# Altium schematic sheet Urukul_FPGA_LVDS.SchDoc: Fastino
size 420 x 297 mm; EDA_Number: ARTIQ; Projet: Fastino; Author: G.Kasprowicz; CompanyName: WUT ISE; DrawnBy: G.Kasprowicz; Organization: WUT ISE; Address1: PW ISE; Address2: Nowowiejska 15/19 00-665 Warsaw; Address3: gkasprow@gmail.com; DocumentNumber: 4; Revision: 2; SheetNumber: 5; SheetTotal: 11; ModifiedBy: -; CheckedDate: -; Title2: FPGA EEM connections; DivGrp: WUT ISE; Designer: G.Kasprowicz; SPICEModelCacheRFUWQEQD: <root> / <DocumentId>RFUWQEQD</DocumentId> / <CacheFrame Number="0"> / <Model Name="pk14" Kind="CKT"> / <Text>*.INC dhvqfn.s / .SUBCKT pk14 / +    1   2   3   4   5   6   7   8   9  10 / +   11  12  13  14 / +   15  16  17  18  19  20  21  22  23  24 / +   25  26  27  28 / * Pin Resistance / r1 1 1001 9.078E-02 / r2 2 1002 8.829E-02 / r3 3 1003 8.731E-02 / r4 4 1004 8.710E-02 / r5 5 1005 8.731E-02 / r6 6 1006 8.829E-02 / r7 7 1007 9.075E-02 / r8 8 1008 9.072E-02 / r9 9 1009 8.809E-02 / r10 10 1010 8.716E-02 / r11 11 1011 8.706E-02 / r12 12 1012 8.720E-02 / r13 13 1013 8.816E-02 / r14 14 1014 9.068E-02 / * Pin Inductance / l1 1001 15 2.981E-09 / l2 1002 16 2.447E-09 / l3 1003 17 2.304E-09 / l4 1004 18 2.291E-09 / l5 1005 19 2.307E-09 / l6 1006 20 2.449E-09 / l7 1007 21 2.971E-09 / l8 1008 22 2.972E-09 / l9 1009 23 2.425E-09 / l10 1010 24 2.286E-09 / l11 1011 25 2.280E-09 / l12 1012 26 2.286E-09 / l13 1013 27 2.425E-09 / l14 1014 28 2.975E-09 / .ENDS pk14</Text> / </Model> / </CacheFrame> / </root>; ModifiedDate: -; ProjectName: Sensor Box
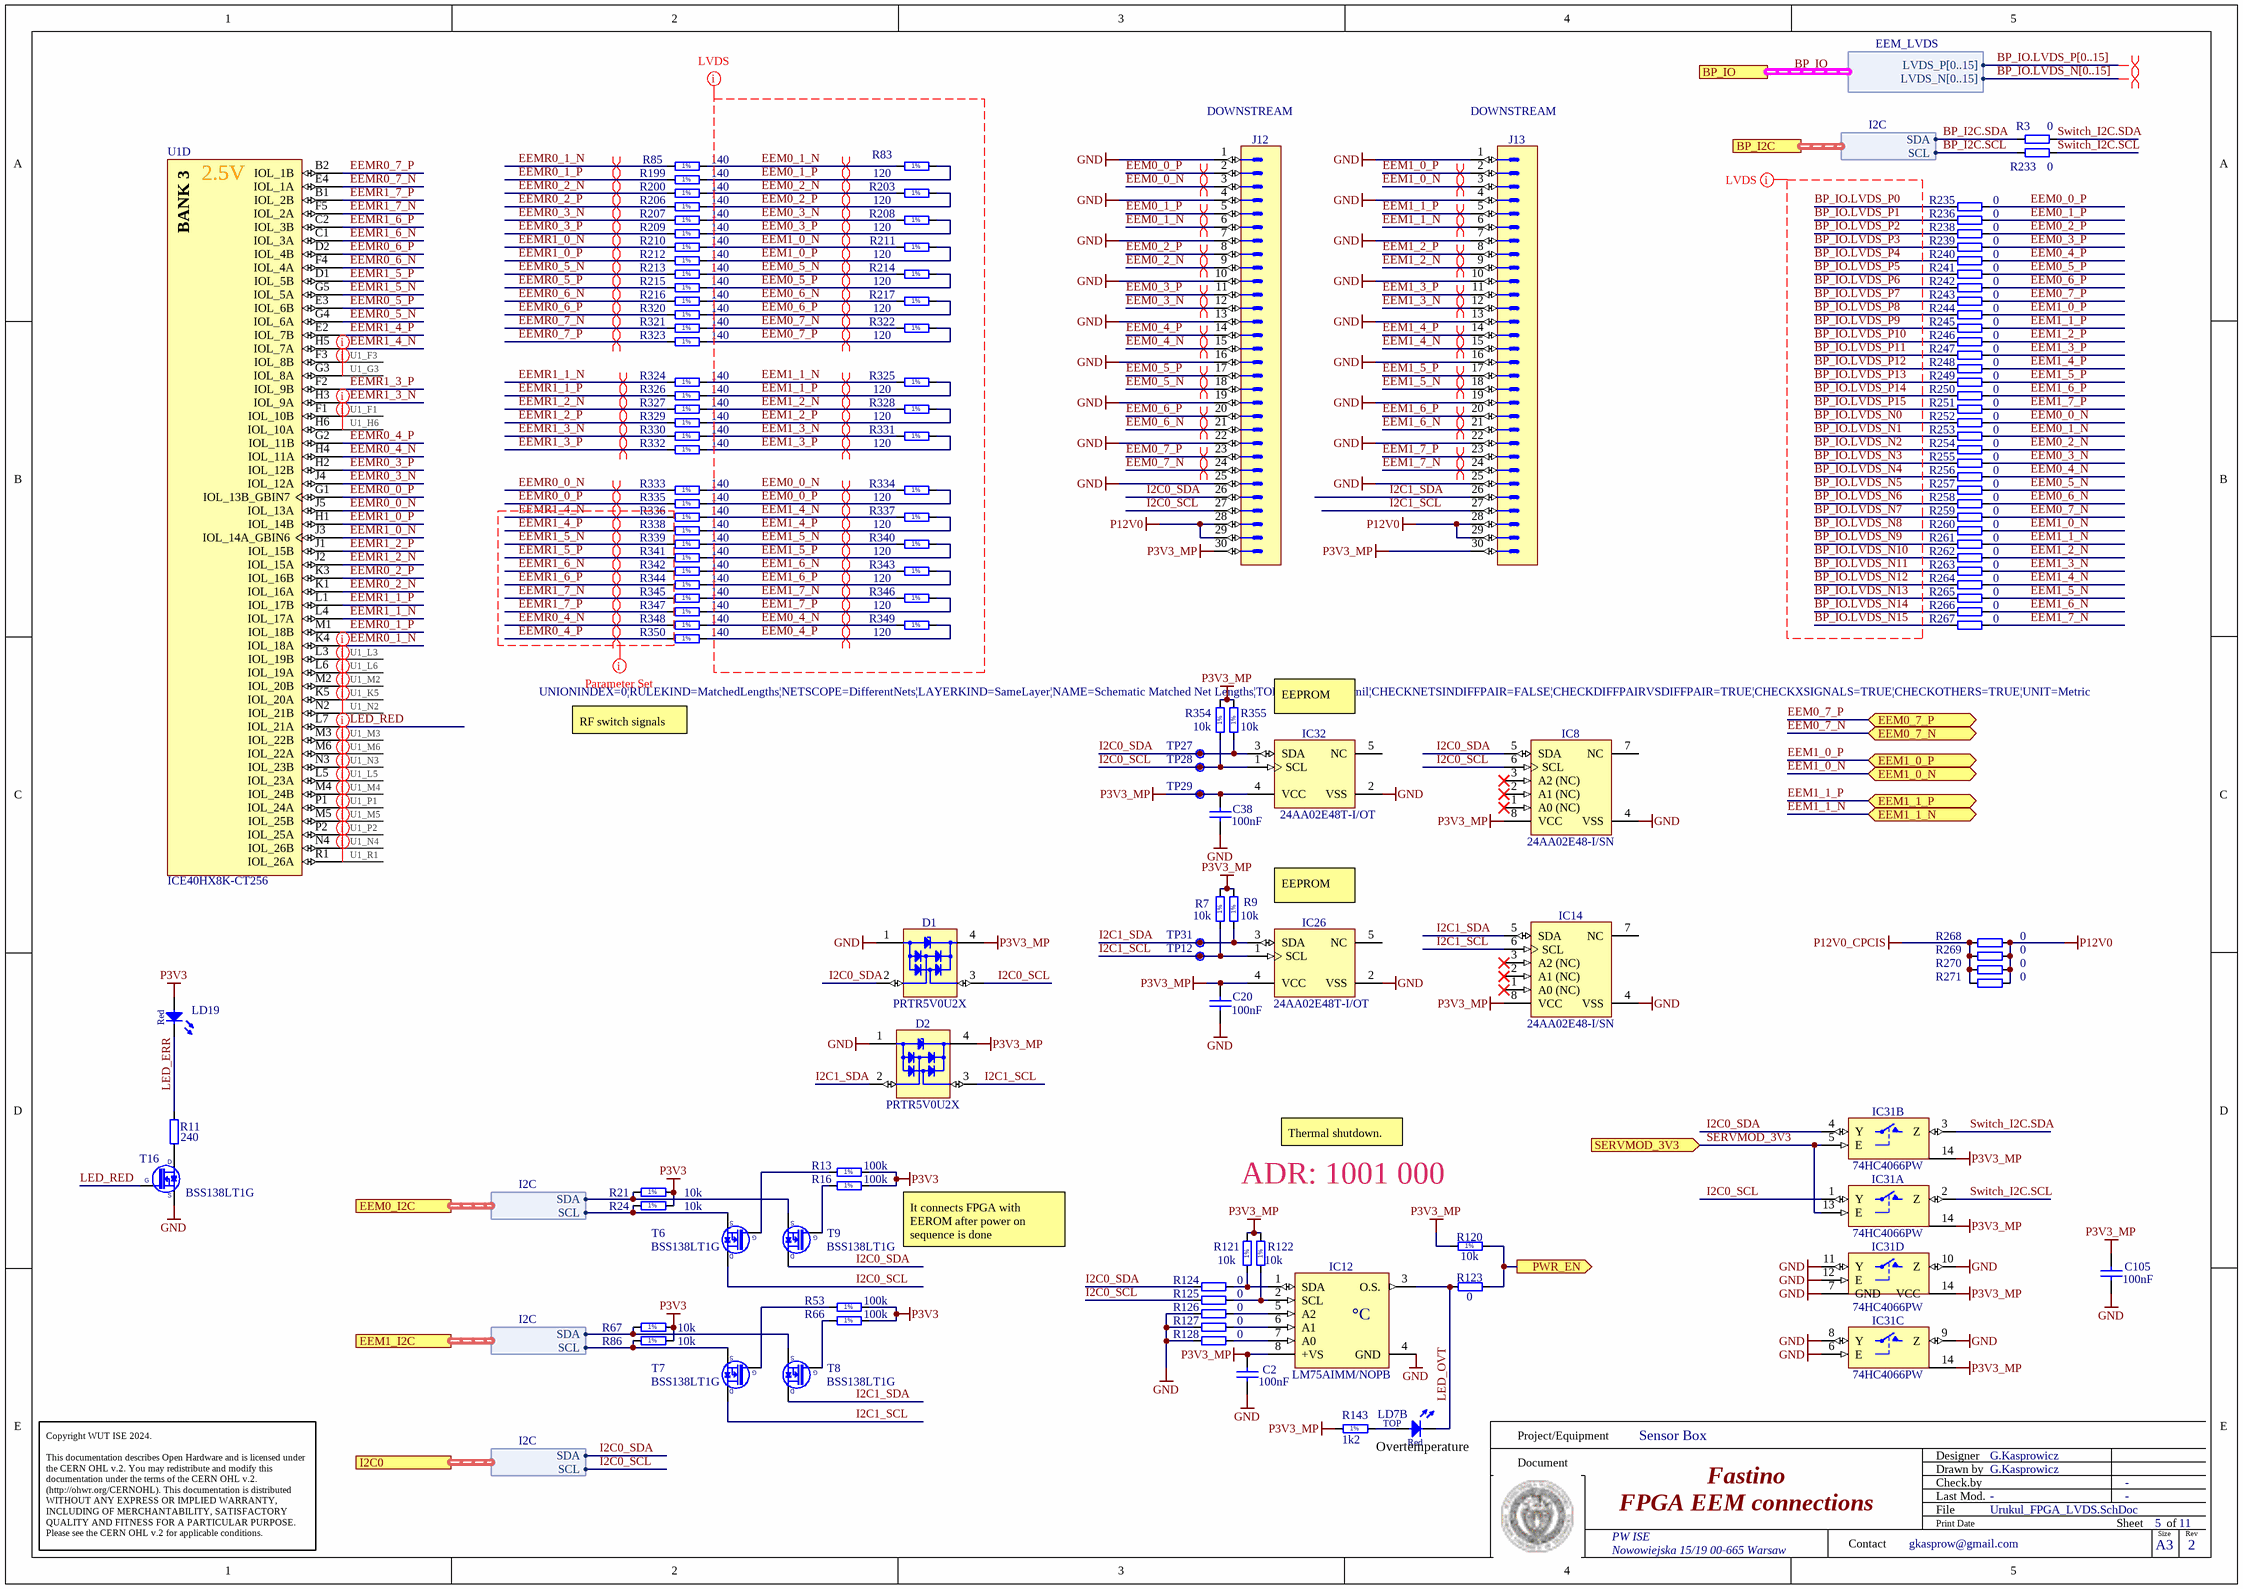
[diagram p0: Urukul_FPGA_LVDS.SchDoc]

## Parts
C2  100nF  [CAPC1005X55N]
C20  100nF  [CAPC1005X55N]
C38  100nF  [CAPC1005X55N]
C105  100nF  [CAPC1005X55N]
D1  PRTR5V0U2X  [SOT190P230X110-4N]
D2  PRTR5V0U2X  [SOT190P230X110-4N]
IC8  24AA02E48-I/SN  [SOIC127P600X175-8N]
IC12  LM75AIMM/NOPB  [SOP65P490X109-8N]
IC14  24AA02E48-I/SN  [SOIC127P600X175-8N]
IC26  24AA02E48T-I/OT  [SOT95P280X145-5N]
IC31  74HC4066PW  [SOP65P640X110-14N]  (parts A,B,C,D of 4)
IC32  24AA02E48T-I/OT  [SOT95P280X145-5N]
J12  (no value)  [3M_N2530-6002RB]
J13  (no value)  [3M_N2530-6002RB]
LD7  Red/Green  [LED_DIALIGHT_571-0112F]  (value not drawn)  (part B of 2)
LD19  Red  [LED_AVAGO_HSMC-C120]
R3  0  [RESC1005X40N]
R7  10k  [RESC1005X40N]
R9  10k  [RESC1005X40N]
R11  240  [RESC1005X40N]
R13  100k  [RESC1005X40N]
R16  100k  [RESC1005X40N]
R21  10k  [RESC1005X40N]
R24  10k  [RESC1005X40N]
R53  100k  [RESC1005X40N]
R66  100k  [RESC1005X40N]
R67  10k  [RESC1005X40N]
R83  120  [RESC1005X40N]
R85  140  [RESC0603X28N]
R86  10k  [RESC1005X40N]
R120  10k  [RESC1005X40N]
R121  10k  [RESC1005X40N]
R122  10k  [RESC1005X40N]
R123  0  [RESC1005X40N]
R124  0  [RESC1005X40N]
R125  0  [RESC1005X40N]
R126  0  [RESC1005X40N]
R127  0  [RESC1005X40N]
R128  0  [RESC1005X40N]
R143  1k2  [RESC1608X55N]
R199  140  [RESC0603X28N]
R200  140  [RESC0603X28N]
R203  120  [RESC1005X40N]
R206  140  [RESC0603X28N]
R207  140  [RESC0603X28N]
R208  120  [RESC1005X40N]
R209  140  [RESC0603X28N]
R210  140  [RESC0603X28N]
R211  120  [RESC1005X40N]
R212  140  [RESC0603X28N]
R213  140  [RESC0603X28N]
R214  120  [RESC1005X40N]
R215  140  [RESC0603X28N]
R216  140  [RESC0603X28N]
R217  120  [RESC1005X40N]
R233  0  [RESC1005X40N]
R235  0  [RESC1005X40N]
R236  0  [RESC1005X40N]
R238  0  [RESC1005X40N]
R239  0  [RESC1005X40N]
R240  0  [RESC1005X40N]
R241  0  [RESC1005X40N]
R242  0  [RESC1005X40N]
R243  0  [RESC1005X40N]
R244  0  [RESC1005X40N]
R245  0  [RESC1005X40N]
R246  0  [RESC1005X40N]
R247  0  [RESC1005X40N]
R248  0  [RESC1005X40N]
R249  0  [RESC1005X40N]
R250  0  [RESC1005X40N]
R251  0  [RESC1005X40N]
R252  0  [RESC1005X40N]
R253  0  [RESC1005X40N]
R254  0  [RESC1005X40N]
R255  0  [RESC1005X40N]
R256  0  [RESC1005X40N]
R257  0  [RESC1005X40N]
R258  0  [RESC1005X40N]
R259  0  [RESC1005X40N]
R260  0  [RESC1005X40N]
R261  0  [RESC1005X40N]
R262  0  [RESC1005X40N]
R263  0  [RESC1005X40N]
R264  0  [RESC1005X40N]
R265  0  [RESC1005X40N]
R266  0  [RESC1005X40N]
R267  0  [RESC1005X40N]
R268  0  [RESC1005X40N]
R269  0  [RESC1005X40N]
R270  0  [RESC1005X40N]
R271  0  [RESC1005X40N]
R320  140  [RESC0603X28N]
R321  140  [RESC0603X28N]
R322  120  [RESC1005X40N]
R323  140  [RESC0603X28N]
R324  140  [RESC0603X28N]
R325  120  [RESC1005X40N]
R326  140  [RESC0603X28N]
R327  140  [RESC0603X28N]
R328  120  [RESC1005X40N]
R329  140  [RESC0603X28N]
R330  140  [RESC0603X28N]
R331  120  [RESC1005X40N]
R332  140  [RESC0603X28N]
R333  140  [RESC0603X28N]
R334  120  [RESC1005X40N]
R335  140  [RESC0603X28N]
R336  140  [RESC0603X28N]
R337  120  [RESC1005X40N]
R338  140  [RESC0603X28N]
R339  140  [RESC0603X28N]
R340  120  [RESC1005X40N]
R341  140  [RESC0603X28N]
R342  140  [RESC0603X28N]
R343  120  [RESC1005X40N]
R344  140  [RESC0603X28N]
R345  140  [RESC0603X28N]
R346  120  [RESC1005X40N]
R347  140  [RESC0603X28N]
R348  140  [RESC0603X28N]
R349  120  [RESC1005X40N]
R350  140  [RESC0603X28N]
R354  10k  [RESC1005X40N]
R355  10k  [RESC1005X40N]
T6  BSS138LT1G  [SOT95P240X110-3N]
T7  BSS138LT1G  [SOT95P240X110-3N]
T8  BSS138LT1G  [SOT95P240X110-3N]
T9  BSS138LT1G  [SOT95P240X110-3N]
T16  BSS138LT1G  [SOT95P240X110-3N]
TP12  Test Point  [TPS127]  (value not drawn)  (no BOM)
TP27  Test Point  [TPS127]  (value not drawn)  (no BOM)
TP28  Test Point  [TPS127]  (value not drawn)  (no BOM)
TP29  Test Point  [TPS127]  (value not drawn)  (no BOM)
TP31  Test Point  [TPS127]  (value not drawn)  (no BOM)
U1  ICE40HX8K-CT256  [LATC-caBGA-256]  (part D of 5)

## Ports
BP_I2C (harness I2C), BP_IO (harness EEM_LVDS), EEM0_7_N (bidir), EEM0_7_P (bidir), EEM0_I2C (harness I2C), EEM1_0_N (bidir), EEM1_0_P (bidir), EEM1_1_N (bidir), EEM1_1_P (bidir), EEM1_I2C (harness I2C), I2C0 (harness I2C), PWR_EN (out), SERVMOD_3V3 (in)

## Harnesses
I2C: SDA, SCL
EEM_LVDS: LVDS_P[0..15], LVDS_N[0..15]

## Nets
GND: C2.1 C20.1 C38.1 C105.1 D1.1(GND) D2.1(GND) IC8.4(VSS) IC12.4(GND) IC14.4(VSS) IC26.2(VSS) IC31.6(E) IC31.7(GND) IC31.8(Y) IC31.9(Z) IC31.10(Z) IC31.11(Y) IC31.12(E) IC32.2(VSS) J12.1 J12.4 J12.7 J12.10 J12.13 J12.16 J12.19 J12.22 J12.25 J13.1 J13.4 J13.7 J13.10 J13.13 J13.16 J13.19 J13.22 J13.25 R126.1 R127.1 R128.1 T16.2(S)
P3V3: LD19.2(A) R13.2 R16.2 R21.2 R24.2 R53.2 R66.2 R67.2 R86.2
P3V3_MP: C2.2 C20.2 C38.2 C105.2 D1.4(VCC) D2.4(VCC) IC8.8(VCC) IC12.8(+VS) IC14.8(VCC) IC26.4(VCC) IC31.14(VCC) IC32.4(VCC) J12.30 J13.30 R7.2 R9.2 R120.1 R121.2 R122.2 R143.1 R354.2 R355.2 TP29.1
P12V0: J12.28 J12.29 J13.28 J13.29 R268.2 R269.2 R270.2 R271.2
P12V0_CPCIS: R268.1 R269.1 R270.1 R271.1
BP_I2C.SCL: R233.1 ; port BP_I2C.SCL
BP_I2C.SDA: R3.1 ; port BP_I2C.SDA
BP_IO.LVDS_N0: R252.1
BP_IO.LVDS_N1: R253.1
BP_IO.LVDS_N2: R254.1
BP_IO.LVDS_N3: R255.1
BP_IO.LVDS_N4: R256.1
BP_IO.LVDS_N5: R257.1
BP_IO.LVDS_N6: R258.1
BP_IO.LVDS_N7: R259.1
BP_IO.LVDS_N8: R260.1
BP_IO.LVDS_N9: R261.1
BP_IO.LVDS_N10: R262.1
BP_IO.LVDS_N11: R263.1
BP_IO.LVDS_N12: R264.1
BP_IO.LVDS_N13: R265.1
BP_IO.LVDS_N14: R266.1
BP_IO.LVDS_N15: R267.1
BP_IO.LVDS_P0: R235.1
BP_IO.LVDS_P1: R236.1
BP_IO.LVDS_P2: R238.1
BP_IO.LVDS_P3: R239.1
BP_IO.LVDS_P4: R240.1
BP_IO.LVDS_P5: R241.1
BP_IO.LVDS_P6: R242.1
BP_IO.LVDS_P7: R243.1
BP_IO.LVDS_P8: R244.1
BP_IO.LVDS_P9: R245.1
BP_IO.LVDS_P10: R246.1
BP_IO.LVDS_P11: R247.1
BP_IO.LVDS_P12: R248.1
BP_IO.LVDS_P13: R249.1
BP_IO.LVDS_P14: R250.1
BP_IO.LVDS_P15: R251.1
EEM0_0_N: J12.3 R252.2 R333.2 R334.1
EEM0_0_P: J12.2 R235.2 R334.2 R335.2
EEM0_1_N: J12.6 R83.1 R85.2 R253.2
EEM0_1_P: J12.5 R83.2 R199.2 R236.2
EEM0_2_N: J12.9 R200.2 R203.1 R254.2
EEM0_2_P: J12.8 R203.2 R206.2 R238.2
EEM0_3_N: J12.12 R207.2 R208.1 R255.2
EEM0_3_P: J12.11 R208.2 R209.2 R239.2
EEM0_4_N: J12.15 R256.2 R348.2 R349.1
EEM0_4_P: J12.14 R240.2 R349.2 R350.2
EEM0_5_N: J12.18 R213.2 R214.1 R257.2
EEM0_5_P: J12.17 R214.2 R215.2 R241.2
EEM0_6_N: J12.21 R216.2 R217.1 R258.2
EEM0_6_P: J12.20 R217.2 R242.2 R320.2
EEM0_7_N: J12.24 R259.2 R321.2 R322.1 ; port EEM0_7_N
EEM0_7_P: J12.23 R243.2 R322.2 R323.2 ; port EEM0_7_P
EEM1_0_N: J13.3 R210.2 R211.1 R260.2 ; port EEM1_0_N
EEM1_0_P: J13.2 R211.2 R212.2 R244.2 ; port EEM1_0_P
EEM1_1_N: J13.6 R261.2 R324.2 R325.1 ; port EEM1_1_N
EEM1_1_P: J13.5 R245.2 R325.2 R326.2 ; port EEM1_1_P
EEM1_2_N: J13.9 R262.2 R327.2 R328.1
EEM1_2_P: J13.8 R246.2 R328.2 R329.2
EEM1_3_N: J13.12 R263.2 R330.2 R331.1
EEM1_3_P: J13.11 R247.2 R331.2 R332.2
EEM1_4_N: J13.15 R264.2 R336.2 R337.1
EEM1_4_P: J13.14 R248.2 R337.2 R338.2
EEM1_5_N: J13.18 R265.2 R339.2 R340.1
EEM1_5_P: J13.17 R249.2 R340.2 R341.2
EEM1_6_N: J13.21 R266.2 R342.2 R343.1
EEM1_6_P: J13.20 R250.2 R343.2 R344.2
EEM1_7_N: J13.24 R267.2 R345.2 R346.1
EEM1_7_P: J13.23 R251.2 R346.2 R347.2
EEMR0_0_N: R333.1 U1.J5(IOL_13A)
EEMR0_0_P: R335.1 U1.G1(IOL_13B_GBIN7)
EEMR0_1_N: R85.1 U1.K4(IOL_18A)
EEMR0_1_P: R199.1 U1.M1(IOL_18B)
EEMR0_2_N: R200.1 U1.K1(IOL_16A)
EEMR0_2_P: R206.1 U1.K3(IOL_16B)
EEMR0_3_N: R207.1 U1.J4(IOL_12A)
EEMR0_3_P: R209.1 U1.H2(IOL_12B)
EEMR0_4_N: R348.1 U1.H4(IOL_11A)
EEMR0_4_P: R350.1 U1.G2(IOL_11B)
EEMR0_5_N: R213.1 U1.G4(IOL_6A)
EEMR0_5_P: R215.1 U1.E3(IOL_6B)
EEMR0_6_N: R216.1 U1.F4(IOL_4A)
EEMR0_6_P: R320.1 U1.D2(IOL_4B)
EEMR0_7_N: R321.1 U1.E4(IOL_1A)
EEMR0_7_P: R323.1 U1.B2(IOL_1B)
EEMR1_0_N: R210.1 U1.J3(IOL_14A_GBIN6)
EEMR1_0_P: R212.1 U1.H1(IOL_14B)
EEMR1_1_N: R324.1 U1.L4(IOL_17A)
EEMR1_1_P: R326.1 U1.L1(IOL_17B)
EEMR1_2_N: R327.1 U1.J2(IOL_15A)
EEMR1_2_P: R329.1 U1.J1(IOL_15B)
EEMR1_3_N: R330.1 U1.H3(IOL_9A)
EEMR1_3_P: R332.1 U1.F2(IOL_9B)
EEMR1_4_N: R336.1 U1.H5(IOL_7A)
EEMR1_4_P: R338.1 U1.E2(IOL_7B)
EEMR1_5_N: R339.1 U1.G5(IOL_5A)
EEMR1_5_P: R341.1 U1.D1(IOL_5B)
EEMR1_6_N: R342.1 U1.C1(IOL_3A)
EEMR1_6_P: R344.1 U1.C2(IOL_3B)
EEMR1_7_N: R345.1 U1.F5(IOL_2A)
EEMR1_7_P: R347.1 U1.B1(IOL_2B)
I2C0_SCL: D1.3(I/O2) IC8.6(SCL) IC31.1(Y) IC32.1(SCL) J12.27 R125.1 R354.1 T6.3(D) TP28.1 ; port I2C0.SCL
I2C0_SDA: D1.2(I/O1) IC8.5(SDA) IC31.4(Y) IC32.3(SDA) J12.26 R124.1 R355.1 T9.3(D) TP27.1 ; port I2C0.SDA
I2C1_SCL: D2.3(I/O2) IC14.6(SCL) IC26.1(SCL) J13.27 R7.1 T7.3(D) TP12.1
I2C1_SDA: D2.2(I/O1) IC14.5(SDA) IC26.3(SDA) J13.26 R9.1 T8.3(D) TP31.1
LED_ERR: LD19.1(C) R11.1
LED_OVT: IC12.3(O.S.) LD7.3(C) R123.1
LED_RED: T16.1(G) U1.L7(IOL_21A)
PWR_EN: R120.2 R123.2 ; port PWR_EN
SERVMOD_3V3: IC31.5(E) IC31.13(E) ; port SERVMOD_3V3
Switch_I2C.SCL: IC31.2(Z) R233.2
Switch_I2C.SDA: IC31.3(Z) R3.2
U1_F1: U1.F1(IOL_10B)
U1_F3: U1.F3(IOL_8B)
U1_G3: U1.G3(IOL_8A)
U1_H6: U1.H6(IOL_10A)
U1_K5: U1.K5(IOL_20A)
U1_L3: U1.L3(IOL_19B)
U1_L5: U1.L5(IOL_23A)
U1_L6: U1.L6(IOL_19A)
U1_M2: U1.M2(IOL_20B)
U1_M3: U1.M3(IOL_22B)
U1_M4: U1.M4(IOL_24B)
U1_M5: U1.M5(IOL_25B)
U1_M6: U1.M6(IOL_22A)
U1_N2: U1.N2(IOL_21B)
U1_N3: U1.N3(IOL_23B)
U1_N4: U1.N4(IOL_26B)
U1_P1: U1.P1(IOL_24A)
U1_P2: U1.P2(IOL_25A)
U1_R1: U1.R1(IOL_26A)
NetIC12_1: IC12.1(SDA) R121.1 R124.2
NetIC12_2: IC12.2(SCL) R122.1 R125.2
NetIC12_5: IC12.5(A2) R126.2
NetIC12_6: IC12.6(A1) R127.2
NetIC12_7: IC12.7(A0) R128.2
NetLD7_4: LD7.4(A) R143.2
NetR11_2: R11.2 T16.3(D)
NetR13_1: R13.1 T6.1(G)
NetR16_1: R16.1 T9.1(G)
NetR21_1: R21.1 T9.2(S) ; port EEM0_I2C.SDA
NetR24_1: R24.1 T6.2(S) ; port EEM0_I2C.SCL
NetR53_1: R53.1 T7.1(G)
NetR66_1: R66.1 T8.1(G)
NetR67_1: R67.1 T8.2(S) ; port EEM1_I2C.SDA
NetR86_1: R86.1 T7.2(S) ; port EEM1_I2C.SCL

Not connected (* = marked no-connect by the designer): IC8 1(A0_(NC))* 2(A1_(NC))* 3(A2_(NC))* 7(NC); IC14 1(A0_(NC))* 2(A1_(NC))* 3(A2_(NC))* 7(NC); IC26 5(NC); IC32 5(NC)

## Buses and harness runs
bus BP_IO.LVDS_N[0..15]
bus BP_IO.LVDS_P[0..15]
harness BP_IO = port BP_IO

## Layout directives
differential pair: EEM0_0_N, EEM0_0_P, EEM0_1_N, EEM0_1_P, EEM0_2_N, EEM0_2_P, EEM0_3_N, EEM0_3_P, EEM0_4_N, EEM0_4_P, EEM0_5_N, EEM0_5_P, EEM0_6_N, EEM0_6_P, EEM0_7_N, EEM0_7_P, EEM1_0_N, EEM1_0_P, EEM1_1_N, EEM1_1_P, EEM1_2_N, EEM1_2_P, EEM1_3_N, EEM1_3_P, EEM1_4_N, EEM1_4_P, EEM1_5_N, EEM1_5_P, EEM1_6_N, EEM1_6_P, EEM1_7_N, EEM1_7_P, EEMR0_0_N, EEMR0_0_P, EEMR0_1_N, EEMR0_1_P, EEMR0_2_N, EEMR0_2_P, EEMR0_3_N, EEMR0_3_P, EEMR0_4_N, EEMR0_4_P, EEMR0_5_N, EEMR0_5_P, EEMR0_6_N, EEMR0_6_P, EEMR0_7_N, EEMR0_7_P, EEMR1_0_N, EEMR1_0_P, EEMR1_1_N, EEMR1_1_P, EEMR1_2_N, EEMR1_2_P, EEMR1_3_N, EEMR1_3_P, EEMR1_4_N, EEMR1_4_P, EEMR1_5_N, EEMR1_5_P, EEMR1_6_N, EEMR1_6_P, EEMR1_7_N, EEMR1_7_P
net class LVDS: BP_IO.LVDS_N0, BP_IO.LVDS_N1, BP_IO.LVDS_N2, BP_IO.LVDS_N3, BP_IO.LVDS_N4, BP_IO.LVDS_N5, BP_IO.LVDS_N6, BP_IO.LVDS_N7, BP_IO.LVDS_N8, BP_IO.LVDS_N9, BP_IO.LVDS_N10, BP_IO.LVDS_N11, BP_IO.LVDS_N12, BP_IO.LVDS_N13, BP_IO.LVDS_N14, BP_IO.LVDS_N15, BP_IO.LVDS_P0, BP_IO.LVDS_P1, BP_IO.LVDS_P2, BP_IO.LVDS_P3, BP_IO.LVDS_P4, BP_IO.LVDS_P5, BP_IO.LVDS_P6, BP_IO.LVDS_P7, BP_IO.LVDS_P8, BP_IO.LVDS_P9, BP_IO.LVDS_P10, BP_IO.LVDS_P11, BP_IO.LVDS_P12, BP_IO.LVDS_P13, BP_IO.LVDS_P14, BP_IO.LVDS_P15, EEM0_0_N, EEM0_0_P, EEM0_1_N, EEM0_1_P, EEM0_2_N, EEM0_2_P, EEM0_3_N, EEM0_3_P, EEM0_4_N, EEM0_4_P, EEM0_5_N, EEM0_5_P, EEM0_6_N, EEM0_6_P, EEM0_7_N, EEM0_7_P, EEM1_0_N, EEM1_0_P, EEM1_1_N, EEM1_1_P, EEM1_2_N, EEM1_2_P, EEM1_3_N, EEM1_3_P, EEM1_4_N, EEM1_4_P, EEM1_5_N, EEM1_5_P, EEM1_6_N, EEM1_6_P, EEM1_7_N, EEM1_7_P
differential pair; differential pair class Diff_100Ohm: (no net found under the mark)
rule Matched Net Lengths [Tolerance = 2.54mm]; net class RFSW_CPLD: EEMR0_4_N, EEMR0_4_P, EEMR1_4_N, EEMR1_4_P, EEMR1_5_N, EEMR1_5_P, EEMR1_6_N, EEMR1_6_P, EEMR1_7_N, EEMR1_7_P
net class Unused: U1_F1, U1_F3, U1_G3, U1_H6, U1_K5, U1_L3, U1_L5, U1_L6, U1_M2, U1_M3, U1_M4, U1_M5, U1_M6, U1_N2, U1_N3, U1_N4, U1_P1, U1_P2, U1_R1

## Notes on the sheet
- (near J12) DOWNSTREAM
- (near J13) DOWNSTREAM
- 2.5V
- RF switch signals
- EEPROM
- ADR: 1001 000
- Thermal shutdown.
- It connects FPGA with EEROM after power on sequence is done
- Overtemperature
- Project/Equipment
- Document
- Designer
- Drawn by
- Check.by
- Copyright WUT ISE 2024.
  This documentation describes Open Hardware and is licensed under the CERN OHL v.2. You may redistribute and modify this documentation under the terms of the CERN OHL v.2. (http://ohwr.org/CERNOHL). This documentation is distributed WITHOUT ANY EXPRESS OR IMPLIED WARRANTY, INCLUDING OF MERCHANTABILITY, SATISFACTORY QUALITY AND FITNESS FOR A PARTICULAR PURPOSE. Please see the CERN OHL v.2 for applicable conditions.
- Contact
- File
- Last Mod.
- Print Date
- Sheet
- Size
- A3
- of
- Rev
- (in symbol CMP-0962-00001-1, part D) BANK 3
- (in symbol LED_DIALIGHT_571-0112F, part B) TOP; Red
- (in symbol LM75AIMM/NOPB) °C
- (in symbol R0201_140R_1%_0.05W_200PPM) 1%
- (in symbol R0402_10k_1%_0.0625W_100PPM) 1%
- (in symbol R0402_10K_1%_0.0625W_100PPM) 1%
- (in symbol R0402_100K_1%_0.0625W_100PPM) 1%
- (in symbol R0402_120R_1%_0.0625W_100PPM) 1%
- (in symbol R0603_1K2_1%_0.1W_100PPM) 1%

## Library data of the parts
C2 C20 C38 C105 = CC0402_100NF_16V_10%_X5R: Non-polarised capacitor; Part Description: SMD Multilayer Chip Ceramic Capacitor; Manufacturer: GENERIC; Manufacturer1 Part Number: GRM155R61C104KA88D; Voltage: 16V; TC: X5R; Tolerance: ±10%; Part Number: CC0402_100NF_16V_10%_X5R; Component Kind: Standard; Component Type: Standard; Pin Count: 2; Value: 100nF; Status: None; Manufacturer Part Number: CC0402_100NF_16V_10%_X5R; Case: 0402; Mounted: Yes; Socket: No; SMD: Yes; Sense: No; Manufacturer1 Example: MURATA; Manufacturer1 ComponentHeight: 0.55mm; HelpURL: \\cern.ch\dfs\Applications\Altium\Datasheets\CC0402_X5R_MURATA_GRM.pdf; Author: CERN DEM JLC; CreateDate: 10.12.2013; LatestRevisionDate: 10.12.2013
D1 D2 = PRTR5V0U2X: Ultra Low Capacitance Double Rail-to-Rail ESD Protection Diode; Part Description: Ultra Low Capacitance (1pF) Double Rail-to-Rail ESD Protection Diode (8kV); Manufacturer: NXP SEMICONDUCTORS; Voltage: 5.5V; PressFit: No; Bonding: No; Part Number: PRTR5V0U2X; Component Kind: Standard; Component Type: Standard; Device: PRTR5V0U2X; PackageDescription: SOT143B, SOT, 1.90mm Pitch; 4 Pin, 1.30mm W X 2.90mm L X 1.10mm H body, IPC Medium Density; Manufacturer Part Number: PRTR5V0U2X; Pin Count: 4; Case: SOT143B; Mounted: Yes; Socket: No; SMD: Yes; Sense: No; ComponentHeight: 1.1mm; HelpURL: \\cern.ch\dfs\Applications\Altium\Datasheets\PRTR5V0U2X.pdf; Author: CERN DEM JLC; CreateDate: 22.03.2011; LatestRevisionDate: 22.03.2011
IC8 IC14 = MEM_24AA02E48-I/SN: 1.7V-5.5V, 2K I2C™ Serial EEPROMs with EUI-48™ Node Identity; Manufacturer: MICROCHIP TECHNOLOGY; PressFit: No; Bonding: No; Part Number: 24AA02E48-I/SN; Component Kind: Standard; Component Type: Standard; Device: 24AA02E48-I/SN; PackageDescription: SOIC, 1.27mm Pitch; 8 Pin - Body 4x5mm, IPC Medium Density; Part Description: 1.7V-5.5V, 2K I2C™ Serial EEPROMs with EUI-48™ Node Identity; Manufacturer Part Number: 24AA02E48-I/SN; Pin Count: 8; Case: SOIC8; Mounted: Yes; Socket: No; SMD: Yes; Sense: No; ComponentHeight: 1.75mm; HelpURL: \\cern.ch\dfs\Applications\Altium\Datasheets\24AA025E48-I-SN.pdf; Author: CERN DEM MR; CreateDate: 19.07.2016; LatestRevisionDate: 19.07.2016
IC12 = LM75AIMM/NOPB: Digital Temperature Sensor and Thermal Watchdog with Two-Wire Interface; Part Description: -25° to +100°C ±2°C Digital Temperature Sensor and Thermal Watchdog with Two-Wire Interface; Manufacturer: TEXAS INSTRUMENTS; PressFit: No; Bonding: No; Part Number: LM75AIMM/NOPB; Component Kind: Standard; Component Type: Standard; Device: LM75AIMM/NOPB; PackageDescription: SOP, 0.65mm pitch; 8 pin,3.00mm W X 3.00mm L X 1.09mm H bodyI, PC Medium Density; Manufacturer Part Number: LM75AIMM/NOPB; Pin Count: 8; Case: SSOP8; Mounted: Yes; Socket: No; SMD: Yes; Sense: No; ComponentHeight: 1.09mm; HelpURL: \\cern.ch\dfs\Applications\Altium\Datasheets\LM75AIMM-NOPB.pdf; Author: CERN DEM JLC; CreateDate: 15.10.2012; LatestRevisionDate: 15.10.2012
IC26 IC32 = 24AA02E48T-I/OT: 1.7V-5.5V, 2K I2C Serial EEPROM With EUI-48 Node Identity; Manufacturer: MICROCHIP TECHNOLOGY; PressFit: No; Bonding: No; Part Number: 24AA02E48T-I/OT; Component Kind: Standard; Component Type: Standard; Device: 24AA02E48T-I/OT; PackageDescription: SOT, 0.95mm pitch; 5 pin, 1.60mm W X 2.90mm L X 1.45mm H body, IPC Medium Density; Part Description: 1.7V-5.5V, 2K I2C Serial EEPROM With EUI-48 Node Identity; Manufacturer Part Number: 24AA02E48T-I/OT; Pin Count: 5; Case: SOT23-5; Mounted: Yes; Socket: No; SMD: Yes; Sense: No; ComponentHeight: 1.45mm; HelpURL: \\cern.ch\dfs\Applications\Altium\Datasheets\24AA02E48T-I-OT.pdf; Author: CERN DEM MR; CreateDate: 31.03.2016; LatestRevisionDate: 31.03.2016
IC31 = 74HC4066PW: Part Description: Quad Single-Pole Single-Throw Analog Switch; Manufacturer: NXP SEMICONDUCTORS; PressFit: No; Bonding: No; Table: Standard Logic; Part Number: 74HC4066PW; Component Kind: Standard; Component Type: Standard; Device: 74HC4066PW; PackageDescription: SOP, 14-Leads, Body 4.4x5mm (max), Pitch 0.65mm, IPC Medium Density; Manufacturer Part Number: 74HC4066PW; Pin Count: 14; Case: TSSOP14; Mounted: Yes; Socket: No; SMD: Yes; ComponentHeight: 1.1mm; Author: CERN DEM JLC; HelpURL: \\cern.ch\dfs\Applications\Altium\Datasheets\74HC4066PW.pdf; CreateDate: 2014-11-19; LatestRevisionDate: 2014-11-19
J12 J13 = 3M_N2530-6002RB: Connector 30 Male; Part Description: 30 Contacts - Straight .100'' x .100'' Low Profile Four-Wall Header, 2500 Series; Manufacturer: 3M; PressFit: No; Part Number: 3M_N2530-6002RB; Component Kind: Standard; Component Type: Standard; Pin Count: 30; Family: Header 30; Mounted: Yes; Socket: No; SMD: No; Sense: No; Status: None; Manufacturer Part Number: N2530-6002RB; ComponentHeight: 10.03mm; HelpURL: \\cern.ch\dfs\Applications\Altium\Datasheets\3M_N2530-6002RB.pdf; Author: CERN DEM JLC; CreateDate: 11.02.2009; LatestRevisionDate: 11.08.2009
LD7 = LED_DIALIGHT_571-0112F: 2x LED  Botom Green, Top Red; Part Description: Dual 2mm  LEDs, Red Top,Green Bot, CBI® Circuit Board Indicator (Without positioning pins); PressFit: No; Bonding: No; Part Number: LED_DIALIGHT_571-0112F; Component Kind: Standard; Component Type: Standard; Color: Red/Green; PackageDescription: 2x 2mm LED (Top: Red, Bot: Green) PCB Edge Mounting (Without positioning pins) DIALIGHT 571 Serie; Manufacturer: DIALIGHT; Manufacturer Part Number: 571-0112F; Pin Count: 4; Mounted: Yes; Socket: No; SMD: No; Sense: No; ComponentHeight: 8.6mm; HelpURL: \\cern.ch\dfs\Applications\Altium\Datasheets\LED_DIALIGHT_571-0112F.pdf; Author: CERN DEM JLC; CreateDate: 09.11.2009; LatestRevisionDate: 17.03.2010
LD19 = LED_AVAGO_HSMC-C120: LED Red 1C 2A; Part Description: High Performance Right Angle Chip Red LED; Manufacturer: AVAGO TECHNOLOGIES; PressFit: No; Bonding: No; Part Number: LED_AVAGO_HSMC-C120; Component Kind: Standard; Component Type: Standard; Color: Red; PackageDescription: Red Chip LED, 2-Leads, Body 1.7x1.1mm, Side Emitting Package; Manufacturer Part Number: HSMC-C120; Pin Count: 2; Mounted: Yes; Socket: No; SMD: Yes; Sense: No; ComponentHeight: 0.7mm; HelpURL: \\cern.ch\dfs\Applications\Altium\Datasheets\LED_AVAGO_HSMC-C120.pdf; ComponentLink1URL: \\cern.ch\dfs\Applications\Altium\Datasheets\LED_AVAGO_HSMC-C120_DESIGN-GUIDE.pdf; ComponentLink1Description: Design Guide; Author: CERN DEM JMW; CreateDate: 22.07.2009; LatestRevisionDate: 20.06.2012
R3 R233 R235 R236 R238-R271 = R0402_0R_JUMPER: Resistor; Part Description: 1A (0.05R Max DC Resistance) Zero Ohm Jumper; Manufacturer: GENERIC; Manufacturer1 Part Number: 232270591001L; PressFit: No; Part Number: R0402_0R_JUMPER; Component Kind: Standard; Component Type: Standard; Pin Count: 2; Value: 0; Status: Not Recommended; Manufacturer Part Number: R0402_0R_JUMPER; Case: 0402; Mounted: Yes; Sense: No; Socket: No; SMD: Yes; Manufacturer1 Example: YAGEO PHYCOMP; Manufacturer1 ComponentHeight: 0.4mm; HelpURL: \\cern.ch\dfs\Applications\Altium\Datasheets\R0402_Phycomp_RC0402.pdf; Author: CERN DEM JLC; CreateDate: 03.12.2007; LatestRevisionDate: 17.10.2012
R7 R9 R120-R122 R354 R355 = R0402_10K_1%_0.0625W_100PPM: Resistor - 1%; Part Description: General Purpose Thick Film Chip Resistor; Manufacturer: GENERIC; Manufacturer1 Part Number: 232270671003L; TC: ±100ppm/°C; PressFit: No; Part Number: R0402_10K_1%_0.0625W_100PPM; Component Kind: Standard; Component Type: Standard; Pin Count: 2; Value: 10k; Status: Not Recommended; Power: 0.0625W; Tolerance: ±1%; Manufacturer Part Number: R0402_10K_1%_0.0625W_100PPM; Case: 0402; Mounted: Yes; Sense: No; Socket: No; SMD: Yes; Manufacturer1 Example: YAGEO PHYCOMP; Manufacturer1 ComponentHeight: 0.4mm; HelpURL: \\cern.ch\dfs\Applications\Altium\Datasheets\R0402_Phycomp_RC0402.pdf; Author: CERN DEM JLC; CreateDate: 03.12.2007; LatestRevisionDate: 17.10.2012
R11 = R0402_240R_1%_0.0625W_100PPM: Resistor - 1%; Part Description: General Purpose Thick Film Chip Resistor; Manufacturer: GENERIC; Manufacturer1 Part Number: 232270672401L; TC: ±100ppm/°C; PressFit: No; Part Number: R0402_240R_1%_0.0625W_100PPM; Component Kind: Standard; Component Type: Standard; Pin Count: 2; Value: 240; Status: Not Recommended; Power: 0.0625W; Tolerance: ±1%; Manufacturer Part Number: R0402_240R_1%_0.0625W_100PPM; Case: 0402; Mounted: Yes; Sense: No; Socket: No; SMD: Yes; Manufacturer1 Example: YAGEO PHYCOMP; Manufacturer1 ComponentHeight: 0.4mm; HelpURL: \\cern.ch\dfs\Applications\Altium\Datasheets\R0402_Phycomp_RC0402.pdf; Author: CERN DEM JLC; CreateDate: 03.12.2007; LatestRevisionDate: 17.10.2012
R13 R16 R53 R66 = R0402_100K_1%_0.0625W_100PPM: Resistor - 1%; Part Description: General Purpose Thick Film Chip Resistor; Manufacturer: GENERIC; Manufacturer1 Part Number: 232270671004L; TC: ±100ppm/°C; PressFit: No; Part Number: R0402_100K_1%_0.0625W_100PPM; Component Kind: Standard; Component Type: Standard; Pin Count: 2; Value: 100k; Status: Not Recommended; Power: 0.0625W; Tolerance: ±1%; Manufacturer Part Number: R0402_100K_1%_0.0625W_100PPM; Case: 0402; Mounted: Yes; Sense: No; Socket: No; SMD: Yes; Manufacturer1 Example: YAGEO PHYCOMP; Manufacturer1 ComponentHeight: 0.4mm; HelpURL: \\cern.ch\dfs\Applications\Altium\Datasheets\R0402_Phycomp_RC0402.pdf; Author: CERN DEM JLC; CreateDate: 03/12/2007; LatestRevisionDate: 17/10/2012
R21 R24 R67 R86 = R0402_10k_1%_0.0625W_100PPM: Resistor - 1%; Part Description: General Purpose Thick Film Chip Resistor; Manufacturer: GENERIC; Manufacturer1 Part Number: 232270671003L; TC: ±100ppm/°C; PressFit: No; Part Number: R0402_10K_1%_0.0625W_100PPM; Component Kind: Standard; Component Type: Standard; Pin Count: 2; Value: 10k; Status: Not Recommended; Power: 0.0625W; Tolerance: ±1%; Manufacturer Part Number: R0402_10K_1%_0.0625W_100PPM; Case: 0402; Mounted: Yes; Sense: No; Socket: No; SMD: Yes; Manufacturer1 Example: YAGEO PHYCOMP; Manufacturer1 ComponentHeight: 0.4mm; HelpURL: \\cern.ch\dfs\Applications\Altium\Datasheets\R0402_Phycomp_RC0402.pdf; Author: CERN DEM JLC; CreateDate: 03.12.2007; LatestRevisionDate: 17.10.2012
R83 R203 R208 R211 R214 R217 R322 R325 R328 R331 R334 R337 R340 R343 R346 R349 = R0402_120R_1%_0.0625W_100PPM: Resistor - 1%; Part Description: General Purpose Thick Film Chip Resistor; Manufacturer: GENERIC; Manufacturer1 Part Number: 232270671201L; TC: ±100ppm/°C; PressFit: No; Part Number: R0402_120R_1%_0.0625W_100PPM; Component Kind: Standard; Component Type: Standard; Pin Count: 2; Value: 120; Status: Not Recommended; Power: 0.0625W; Tolerance: ±1%; Manufacturer Part Number: R0402_120R_1%_0.0625W_100PPM; Case: 0402; Mounted: Yes; Sense: No; Socket: No; SMD: Yes; Manufacturer1 Example: YAGEO PHYCOMP; Manufacturer1 ComponentHeight: 0.4mm; HelpURL: \\cern.ch\dfs\Applications\Altium\Datasheets\R0402_Phycomp_RC0402.pdf; Author: CERN DEM JLC; CreateDate: 03.12.2007; LatestRevisionDate: 17.10.2012
R85 R199 R200 R206 R207 R209 R210 R212 R213 R215 R216 R320 R321 R323 R324 R326 R327 R329 R330 R332 R333 R335 R336 R338 R339 R341 R342 R344 R345 R347 R348 R350 = R0201_140R_1%_0.05W_200PPM: Resistor - 1%; Part Description: Thick Film Chip Resistor; Manufacturer: GENERIC; Manufacturer1 Part Number: CRCW0201140RFNED; Power: 0.05W; TC: ±200ppm/°C; PressFit: No; Part Number: R0201_140R_1%_0.05W_200PPM; Component Kind: Standard; Component Type: Standard; Pin Count: 2; Value: 140; Status: Not Recommended; Tolerance: ±1%; Manufacturer Part Number: R0201_140R_1%_0.05W_200PPM; Case: 0201; Mounted: Yes; Sense: No; Socket: No; SMD: Yes; Manufacturer1 Example: VISHAY; Manufacturer1 ComponentHeight: 0.27mm; HelpURL: \\cern.ch\dfs\Applications\Altium\Datasheets\R0201_VISHAY_CRCW e3.pdf; Author: CERN DEM MR; CreateDate: 26/01/2016; LatestRevisionDate: 26/01/2016
R123-R128 = R0402_0R_JUMPER: Resistor; Part Description: 1A (0.05R Max DC Resistance) Zero Ohm Jumper; Manufacturer: GENERIC; Manufacturer1 Part Number: 232270591001L; Part Number: R0402_0R_JUMPER; Component Kind: Standard; Component Type: Standard; Pin Count: 2; Value: 0; Status: Not recommended; Manufacturer Part Number: R0402_0R_JUMPER; Case: 0402; Mounted: Yes; Sense: No; Socket: No; SMD: Yes; Manufacturer1 Example: YAGEO PHYCOMP; Manufacturer1 ComponentHeight: 0.4mm; HelpURL: \\cern.ch\dfs\Applications\Altium\Datasheets\R0402_Phycomp_RC0402.pdf; Author: CERN DEM JLC; CreateDate: 03.12.2007; LatestRevisionDate: 17.10.2012
R143 = R0603_1K2_1%_0.1W_100PPM: Resistor - 1%; Part Description: General Purpose Thick Film Chip Resistor; Manufacturer: GENERIC; Manufacturer1 Part Number: NRC06F1201TRF; Power: 0.1W; TC: ±100ppm/°C; Part Number: R0603_1K2_1%_0.1W_100PPM; Component Kind: Standard; Component Type: Standard; Pin Count: 2; Value: 1k2; Status: Preferred; Tolerance: ±1%; Manufacturer Part Number: R0603_1K2_1%_0.1W_100PPM; Case: 0603; Mounted: Yes; Sense: No; Socket: No; SMD: Yes; Manufacturer1 Example: NIC COMPONENT; Manufacturer1 ComponentHeight: 0.55mm; HelpURL: \\cern.ch\dfs\Applications\Altium\Datasheets\R0603_NIC_NRC.pdf; Author: CERN DEM JLC; CreateDate: 03.12.2007; LatestRevisionDate: 13.03.2008
T6-T9 T16 = BSS138LT1G: N-CHANNEL MOSFET WITH DIODE; Part Description: 50V 200mA N-Channel Enhancement Mode Field-Effect Transistor; Manufacturer: ON SEMICONDUCTOR; PressFit: No; Bonding: No; Part Number: BSS138LT1G; Component Kind: Standard; Component Type: Standard; Device: BSS138LT1G; PackageDescription: SOT23 3-Leads, Pitch 0.95mm - Body 1.4x3mm, IPC Medium Density; Manufacturer Part Number: BSS138LT1G; Pin Count: 3; Case: SOT23-3; Mounted: Yes; Socket: No; SMD: Yes; Sense: No; ComponentHeight: 1.11mm; HelpURL: \\cern.ch\dfs\Applications\Altium\Datasheets\BSS138LT1G.pdf; Author: CERN DEM JLC; CreateDate: 23.03.2009; LatestRevisionDate: 23.03.2009
TP12 TP27-TP29 TP31 = SMD_PAD_1.27X1.27MM: Part Description: 1.27mm x 1.27mm PCB Copper Area (SMD Test Point); Mounted: No; Part Number: SMD_PAD_1.27X1.27MM; Component Type: Standard (No BOM); Pin Count: 1; Family: Test Point; Socket: No; SMD: Yes; Sense: No; Status: None; ComponentHeight: 0mm; HelpURL: Undefined; Author: CERN DEM JLC; CreateDate: 12.01.2008; LatestRevisionDate: 12.01.2008; PackageDescription: 1.27mm x 1.27mm PCB Copper Area (SMD Test Point)
U1 = CMP-0962-00001-1: iCE40 HX8K Series FPGA Family, 7680 Logic Cells, 1.2 V Core, 128 K Embedded RAM Bits, 256-ball caBGA, Pb-Free, Tray; Manufacturer: Lattice Semiconductor; Supply Voltage: 1.2V; Phase-Locked Loops: 2; Logic Cells: 7680; Embedded RAM Bits: 128K; PackageReference: caBGA-256; PackageDescription: 256-Ball Chip Array Ball Grid Array, Body 14 x 14 mm, Pitch 0.8 mm; RoHS: TRUE; Packing: Tray; Mounting Technology: Surface Mount; ComponentLink3URL: http://www.latticesemi.com/lit/docs/package/pkg.pdf; ComponentLink1Description: Manufacturer URL; ComponentLink3Description: Package Specification; Code_JEDEC: MO-275; PackageVersion: Rev. 03.9, 02/2013; ComponentLink1URL: http://www.latticesemi.com/en; ComponentLink2URL: http://www.latticesemi.com/~/media/Documents/DataSheets/iCE/iCE40LPHXFamilyDataSheet.pdf; Manufacturer Part Number: ICE40HX8K-CT256; ComponentLink2Description: Datasheet; DatasheetVersion: Rev. 02.9; Part Number: ICE40HX8K-CT256